# Altium schematic sheet FPGA_BANK_B.SchDoc
size A3; Organization: ICNS, MARCS Institute; Address1: Werrington South Campus, Great Western Highway; Address2: Werrington, NSW, 2747; SheetNumber: 4; SheetTotal: 16
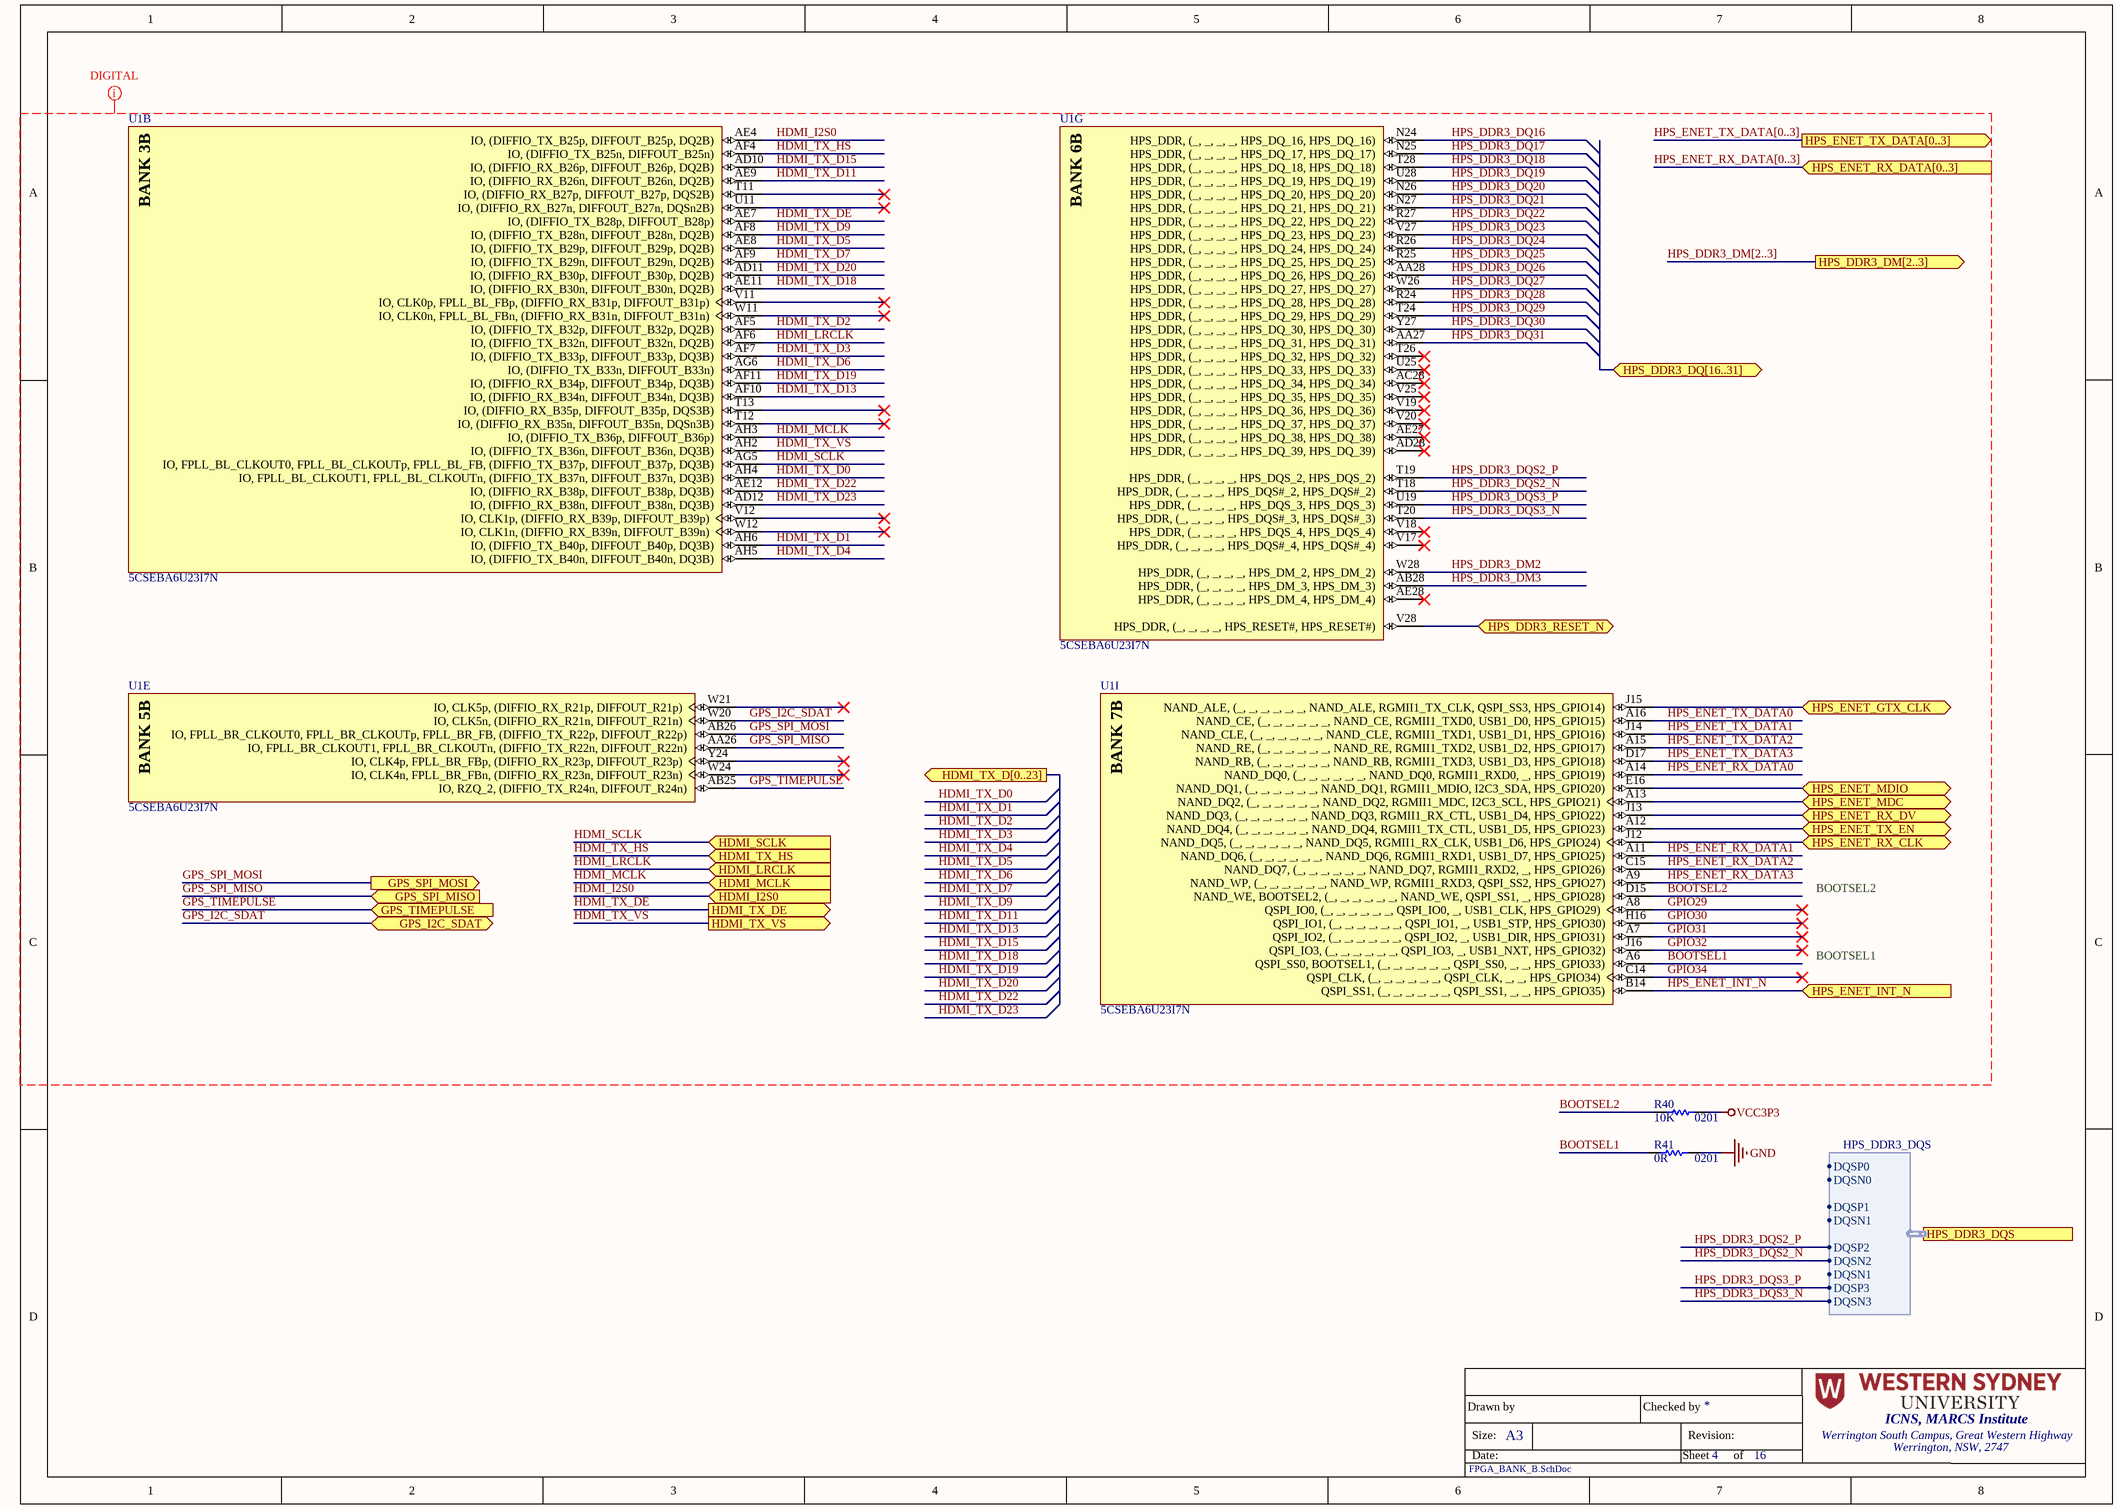
[diagram p0: FPGA_BANK_B.SchDoc]

## Parts
R40  value 10K  Case Code (Imperial): 0201  [RES 0201 (0603)]  (hidden comment: AC0201FR-0710KL)
R41  value 0R  Case Code (Imperial): 0201  [RES 0201 (0603)]  (hidden comment: AF0201JR-070RL)
U1  5CSEBA6U23I7N  [ALTR-UBGA672_A-185]  (parts B,E,G,I of 21)

## Ports
GPS_I2C_SDAT (bidir), GPS_SPI_MISO (in), GPS_SPI_MOSI (out), GPS_TIMEPULSE (in), HDMI_I2S0 (in), HDMI_LRCLK (in), HDMI_MCLK (in), HDMI_SCLK (in), HDMI_TX_D[0..23] (out), HDMI_TX_DE (out), HDMI_TX_HS (in), HDMI_TX_VS (out), HPS_DDR3_DM[2..3] (out), HPS_DDR3_DQ[16..31] (bidir), HPS_DDR3_DQS (harness HPS_DDR3_DQS), HPS_DDR3_RESET_N (bidir), HPS_ENET_GTX_CLK (bidir), HPS_ENET_INT_N (in), HPS_ENET_MDC (bidir), HPS_ENET_MDIO (bidir), HPS_ENET_RX_CLK (bidir), HPS_ENET_RX_DATA[0..3] (in), HPS_ENET_RX_DV (bidir), HPS_ENET_TX_DATA[0..3] (out), HPS_ENET_TX_EN (bidir)

## Harnesses
HPS_DDR3_DQS: DQSP0, DQSP1, DQSP2, DQSP3, DQSN0, DQSN1, DQSN2, DQSN3, DQSN1

## Nets
GND: R41.2
VCC3P3: R40.1
BOOTSEL1: R41.1 U1.A6(QSPI_SS0,_BOOTSEL1,_(_,__,__,__,__,__,_QSPI_SS0,__,__,_HPS_GPIO33))
BOOTSEL2: R40.2 U1.D15(NAND_WE,_BOOTSEL2,_(_,__,__,__,__,__,_NAND_WE,_QSPI_SS1,__,_HPS_GPIO28))
GPIO29: U1.A8(QSPI_IO0,_(_,__,__,__,__,__,_QSPI_IO0,__,_USB1_CLK,_HPS_GPIO29))
GPIO30: U1.H16(QSPI_IO1,_(_,__,__,__,__,__,_QSPI_IO1,__,_USB1_STP,_HPS_GPIO30))
GPIO31: U1.A7(QSPI_IO2,_(_,__,__,__,__,__,_QSPI_IO2,__,_USB1_DIR,_HPS_GPIO31))
GPIO32: U1.J16(QSPI_IO3,_(_,__,__,__,__,__,_QSPI_IO3,__,_USB1_NXT,_HPS_GPIO32))
GPIO34: U1.C14(QSPI_CLK,_(_,__,__,__,__,__,_QSPI_CLK,__,__,_HPS_GPIO34))
GPS_I2C_SDAT: U1.W20(IO,_CLK5n,_(DIFFIO_RX_R21n,_DIFFOUT_R21n)) ; port GPS_I2C_SDAT
GPS_SPI_MISO: U1.AA26(IO,_FPLL_BR_CLKOUT1,_FPLL_BR_CLKOUTn,_(DIFFIO_TX_R22n,_DIFFOUT_R22n)) ; port GPS_SPI_MISO
GPS_SPI_MOSI: U1.AB26(IO,_FPLL_BR_CLKOUT0,_FPLL_BR_CLKOUTp,_FPLL_BR_FB,_(DIFFIO_TX_R22p,_DIFFOUT_R22p)) ; port GPS_SPI_MOSI
GPS_TIMEPULSE: U1.AB25(IO,_RZQ_2,_(DIFFIO_TX_R24n,_DIFFOUT_R24n)) ; port GPS_TIMEPULSE
HDMI_I2S0: U1.AE4(IO,_(DIFFIO_TX_B25p,_DIFFOUT_B25p,_DQ2B)) ; port HDMI_I2S0
HDMI_LRCLK: U1.AF6(IO,_(DIFFIO_TX_B32n,_DIFFOUT_B32n,_DQ2B)) ; port HDMI_LRCLK
HDMI_MCLK: U1.AH3(IO,_(DIFFIO_TX_B36p,_DIFFOUT_B36p)) ; port HDMI_MCLK
HDMI_SCLK: U1.AG5(IO,_FPLL_BL_CLKOUT0,_FPLL_BL_CLKOUTp,_FPLL_BL_FB,_(DIFFIO_TX_B37p,_DIFFOUT_B37p,_DQ3B)) ; port HDMI_SCLK
HDMI_TX_D0: U1.AH4(IO,_FPLL_BL_CLKOUT1,_FPLL_BL_CLKOUTn,_(DIFFIO_TX_B37n,_DIFFOUT_B37n,_DQ3B))
HDMI_TX_D1: U1.AH6(IO,_(DIFFIO_TX_B40p,_DIFFOUT_B40p,_DQ3B))
HDMI_TX_D2: U1.AF5(IO,_(DIFFIO_TX_B32p,_DIFFOUT_B32p,_DQ2B))
HDMI_TX_D3: U1.AF7(IO,_(DIFFIO_TX_B33p,_DIFFOUT_B33p,_DQ3B))
HDMI_TX_D4: U1.AH5(IO,_(DIFFIO_TX_B40n,_DIFFOUT_B40n,_DQ3B))
HDMI_TX_D5: U1.AE8(IO,_(DIFFIO_TX_B29p,_DIFFOUT_B29p,_DQ2B))
HDMI_TX_D6: U1.AG6(IO,_(DIFFIO_TX_B33n,_DIFFOUT_B33n))
HDMI_TX_D7: U1.AF9(IO,_(DIFFIO_TX_B29n,_DIFFOUT_B29n,_DQ2B))
HDMI_TX_D9: U1.AF8(IO,_(DIFFIO_TX_B28n,_DIFFOUT_B28n,_DQ2B))
HDMI_TX_D11: U1.AE9(IO,_(DIFFIO_RX_B26n,_DIFFOUT_B26n,_DQ2B))
HDMI_TX_D13: U1.AF10(IO,_(DIFFIO_RX_B34n,_DIFFOUT_B34n,_DQ3B))
HDMI_TX_D15: U1.AD10(IO,_(DIFFIO_RX_B26p,_DIFFOUT_B26p,_DQ2B))
HDMI_TX_D18: U1.AE11(IO,_(DIFFIO_RX_B30n,_DIFFOUT_B30n,_DQ2B))
HDMI_TX_D19: U1.AF11(IO,_(DIFFIO_RX_B34p,_DIFFOUT_B34p,_DQ3B))
HDMI_TX_D20: U1.AD11(IO,_(DIFFIO_RX_B30p,_DIFFOUT_B30p,_DQ2B))
HDMI_TX_D22: U1.AE12(IO,_(DIFFIO_RX_B38p,_DIFFOUT_B38p,_DQ3B))
HDMI_TX_D23: U1.AD12(IO,_(DIFFIO_RX_B38n,_DIFFOUT_B38n,_DQ3B))
HDMI_TX_DE: U1.AE7(IO,_(DIFFIO_TX_B28p,_DIFFOUT_B28p)) ; port HDMI_TX_DE
HDMI_TX_HS: U1.AF4(IO,_(DIFFIO_TX_B25n,_DIFFOUT_B25n)) ; port HDMI_TX_HS
HDMI_TX_VS: U1.AH2(IO,_(DIFFIO_TX_B36n,_DIFFOUT_B36n,_DQ3B)) ; port HDMI_TX_VS
HPS_DDR3_DM2: U1.W28(HPS_DDR,_(_,__,__,__,_HPS_DM_2,_HPS_DM_2))
HPS_DDR3_DM3: U1.AB28(HPS_DDR,_(_,__,__,__,_HPS_DM_3,_HPS_DM_3))
HPS_DDR3_DQ16: U1.N24(HPS_DDR,_(_,__,__,__,_HPS_DQ_16,_HPS_DQ_16))
HPS_DDR3_DQ17: U1.N25(HPS_DDR,_(_,__,__,__,_HPS_DQ_17,_HPS_DQ_17))
HPS_DDR3_DQ18: U1.T28(HPS_DDR,_(_,__,__,__,_HPS_DQ_18,_HPS_DQ_18))
HPS_DDR3_DQ19: U1.U28(HPS_DDR,_(_,__,__,__,_HPS_DQ_19,_HPS_DQ_19))
HPS_DDR3_DQ20: U1.N26(HPS_DDR,_(_,__,__,__,_HPS_DQ_20,_HPS_DQ_20))
HPS_DDR3_DQ21: U1.N27(HPS_DDR,_(_,__,__,__,_HPS_DQ_21,_HPS_DQ_21))
HPS_DDR3_DQ22: U1.R27(HPS_DDR,_(_,__,__,__,_HPS_DQ_22,_HPS_DQ_22))
HPS_DDR3_DQ23: U1.V27(HPS_DDR,_(_,__,__,__,_HPS_DQ_23,_HPS_DQ_23))
HPS_DDR3_DQ24: U1.R26(HPS_DDR,_(_,__,__,__,_HPS_DQ_24,_HPS_DQ_24))
HPS_DDR3_DQ25: U1.R25(HPS_DDR,_(_,__,__,__,_HPS_DQ_25,_HPS_DQ_25))
HPS_DDR3_DQ26: U1.AA28(HPS_DDR,_(_,__,__,__,_HPS_DQ_26,_HPS_DQ_26))
HPS_DDR3_DQ27: U1.W26(HPS_DDR,_(_,__,__,__,_HPS_DQ_27,_HPS_DQ_27))
HPS_DDR3_DQ28: U1.R24(HPS_DDR,_(_,__,__,__,_HPS_DQ_28,_HPS_DQ_28))
HPS_DDR3_DQ29: U1.T24(HPS_DDR,_(_,__,__,__,_HPS_DQ_29,_HPS_DQ_29))
HPS_DDR3_DQ30: U1.Y27(HPS_DDR,_(_,__,__,__,_HPS_DQ_30,_HPS_DQ_30))
HPS_DDR3_DQ31: U1.AA27(HPS_DDR,_(_,__,__,__,_HPS_DQ_31,_HPS_DQ_31))
HPS_DDR3_DQS2_N: U1.T18(HPS_DDR,_(_,__,__,__,_HPS_DQS#_2,_HPS_DQS#_2)) ; port HPS_DDR3_DQS.DQSN2
HPS_DDR3_DQS2_P: U1.T19(HPS_DDR,_(_,__,__,__,_HPS_DQS_2,_HPS_DQS_2)) ; port HPS_DDR3_DQS.DQSP2
HPS_DDR3_DQS3_N: U1.T20(HPS_DDR,_(_,__,__,__,_HPS_DQS#_3,_HPS_DQS#_3)) ; port HPS_DDR3_DQS.DQSN3
HPS_DDR3_DQS3_P: U1.U19(HPS_DDR,_(_,__,__,__,_HPS_DQS_3,_HPS_DQS_3)) ; port HPS_DDR3_DQS.DQSP3
HPS_DDR3_RESET_N: U1.V28(HPS_DDR,_(_,__,__,__,_HPS_RESET#,_HPS_RESET#)) ; port HPS_DDR3_RESET_N
HPS_ENET_GTX_CLK: U1.J15(NAND_ALE,_(_,__,__,__,__,__,_NAND_ALE,_RGMII1_TX_CLK,_QSPI_SS3,_HPS_GPIO14)) ; port HPS_ENET_GTX_CLK
HPS_ENET_INT_N: U1.B14(QSPI_SS1,_(_,__,__,__,__,__,_QSPI_SS1,__,__,_HPS_GPIO35)) ; port HPS_ENET_INT_N
HPS_ENET_MDC: U1.A13(NAND_DQ2,_(_,__,__,__,__,__,_NAND_DQ2,_RGMII1_MDC,_I2C3_SCL,_HPS_GPIO21)) ; port HPS_ENET_MDC
HPS_ENET_MDIO: U1.E16(NAND_DQ1,_(_,__,__,__,__,__,_NAND_DQ1,_RGMII1_MDIO,_I2C3_SDA,_HPS_GPIO20)) ; port HPS_ENET_MDIO
HPS_ENET_RX_CLK: U1.J12(NAND_DQ5,_(_,__,__,__,__,__,_NAND_DQ5,_RGMII1_RX_CLK,_USB1_D6,_HPS_GPIO24)) ; port HPS_ENET_RX_CLK
HPS_ENET_RX_DATA0: U1.A14(NAND_DQ0,_(_,__,__,__,__,__,_NAND_DQ0,_RGMII1_RXD0,__,_HPS_GPIO19))
HPS_ENET_RX_DATA1: U1.A11(NAND_DQ6,_(_,__,__,__,__,__,_NAND_DQ6,_RGMII1_RXD1,_USB1_D7,_HPS_GPIO25))
HPS_ENET_RX_DATA2: U1.C15(NAND_DQ7,_(_,__,__,__,__,__,_NAND_DQ7,_RGMII1_RXD2,__,_HPS_GPIO26))
HPS_ENET_RX_DATA3: U1.A9(NAND_WP,_(_,__,__,__,__,__,_NAND_WP,_RGMII1_RXD3,_QSPI_SS2,_HPS_GPIO27))
HPS_ENET_RX_DV: U1.J13(NAND_DQ3,_(_,__,__,__,__,__,_NAND_DQ3,_RGMII1_RX_CTL,_USB1_D4,_HPS_GPIO22)) ; port HPS_ENET_RX_DV
HPS_ENET_TX_DATA0: U1.A16(NAND_CE,_(_,__,__,__,__,__,_NAND_CE,_RGMII1_TXD0,_USB1_D0,_HPS_GPIO15))
HPS_ENET_TX_DATA1: U1.J14(NAND_CLE,_(_,__,__,__,__,__,_NAND_CLE,_RGMII1_TXD1,_USB1_D1,_HPS_GPIO16))
HPS_ENET_TX_DATA2: U1.A15(NAND_RE,_(_,__,__,__,__,__,_NAND_RE,_RGMII1_TXD2,_USB1_D2,_HPS_GPIO17))
HPS_ENET_TX_DATA3: U1.D17(NAND_RB,_(_,__,__,__,__,__,_NAND_RB,_RGMII1_TXD3,_USB1_D3,_HPS_GPIO18))
HPS_ENET_TX_EN: U1.A12(NAND_DQ4,_(_,__,__,__,__,__,_NAND_DQ4,_RGMII1_TX_CTL,_USB1_D5,_HPS_GPIO23)) ; port HPS_ENET_TX_EN

Not connected (* = marked no-connect by the designer): U1 AC28(HPS_DDR,_(_,__,__,__,_HPS_DQ_34,_HPS_DQ_34))* AD28(HPS_DDR,_(_,__,__,__,_HPS_DQ_39,_HPS_DQ_39))* AE27(HPS_DDR,_(_,__,__,__,_HPS_DQ_38,_HPS_DQ_38))* AE28(HPS_DDR,_(_,__,__,__,_HPS_DM_4,_HPS_DM_4))* T11(IO,_(DIFFIO_RX_B27p,_DIFFOUT_B27p,_DQS2B))* T12(IO,_(DIFFIO_RX_B35n,_DIFFOUT_B35n,_DQSn3B))* T13(IO,_(DIFFIO_RX_B35p,_DIFFOUT_B35p,_DQS3B))* T26(HPS_DDR,_(_,__,__,__,_HPS_DQ_32,_HPS_DQ_32))* U11(IO,_(DIFFIO_RX_B27n,_DIFFOUT_B27n,_DQSn2B))* U25(HPS_DDR,_(_,__,__,__,_HPS_DQ_33,_HPS_DQ_33))* V11(IO,_CLK0p,_FPLL_BL_FBp,_(DIFFIO_RX_B31p,_DIFFOUT_B31p))* V12(IO,_CLK1p,_(DIFFIO_RX_B39p,_DIFFOUT_B39p))* V17(HPS_DDR,_(_,__,__,__,_HPS_DQS#_4,_HPS_DQS#_4))* V18(HPS_DDR,_(_,__,__,__,_HPS_DQS_4,_HPS_DQS_4))* V19(HPS_DDR,_(_,__,__,__,_HPS_DQ_36,_HPS_DQ_36))* V20(HPS_DDR,_(_,__,__,__,_HPS_DQ_37,_HPS_DQ_37))* V25(HPS_DDR,_(_,__,__,__,_HPS_DQ_35,_HPS_DQ_35))* W11(IO,_CLK0n,_FPLL_BL_FBn,_(DIFFIO_RX_B31n,_DIFFOUT_B31n))* W12(IO,_CLK1n,_(DIFFIO_RX_B39n,_DIFFOUT_B39n))* W21(IO,_CLK5p,_(DIFFIO_RX_R21p,_DIFFOUT_R21p))* W24(IO,_CLK4n,_FPLL_BR_FBn,_(DIFFIO_RX_R23n,_DIFFOUT_R23n))* Y24(IO,_CLK4p,_FPLL_BR_FBp,_(DIFFIO_RX_R23p,_DIFFOUT_R23p))*

## Buses and harness runs
bus HPS_DDR3_DM[2..3] = port HPS_DDR3_DM[2..3]
bus HPS_ENET_RX_DATA[0..3] = port HPS_ENET_RX_DATA[0..3]
bus HPS_ENET_TX_DATA[0..3] = port HPS_ENET_TX_DATA[0..3]

## Layout directives
net class DIGITAL: BOOTSEL1, BOOTSEL2, GPIO29, GPIO30, GPIO31, GPIO32, GPIO34, GPS_I2C_SDAT, GPS_SPI_MISO, GPS_SPI_MOSI, GPS_TIMEPULSE, HDMI_I2S0, HDMI_LRCLK, HDMI_MCLK, HDMI_SCLK, HDMI_TX_D0, HDMI_TX_D1, HDMI_TX_D2, HDMI_TX_D3, HDMI_TX_D4, HDMI_TX_D5, HDMI_TX_D6, HDMI_TX_D7, HDMI_TX_D9, HDMI_TX_D11, HDMI_TX_D13, HDMI_TX_D15, HDMI_TX_D18, HDMI_TX_D19, HDMI_TX_D20, HDMI_TX_D22, HDMI_TX_D23, HDMI_TX_DE, HDMI_TX_HS, HDMI_TX_VS, HPS_DDR3_DM2, HPS_DDR3_DM3, HPS_DDR3_DM[2..3], HPS_DDR3_DQ16, HPS_DDR3_DQ17, HPS_DDR3_DQ18, HPS_DDR3_DQ19, HPS_DDR3_DQ20, HPS_DDR3_DQ21, HPS_DDR3_DQ22, HPS_DDR3_DQ23, HPS_DDR3_DQ24, HPS_DDR3_DQ25, HPS_DDR3_DQ26, HPS_DDR3_DQ27, HPS_DDR3_DQ28, HPS_DDR3_DQ29, HPS_DDR3_DQ30, HPS_DDR3_DQ31, HPS_DDR3_DQS2_N, HPS_DDR3_DQS2_P, HPS_DDR3_DQS3_N, HPS_DDR3_DQS3_P, HPS_ENET_INT_N, HPS_ENET_RX_DATA0, HPS_ENET_RX_DATA1, HPS_ENET_RX_DATA2, HPS_ENET_RX_DATA3, HPS_ENET_RX_DATA[0..3], HPS_ENET_TX_DATA0, HPS_ENET_TX_DATA1, HPS_ENET_TX_DATA2, HPS_ENET_TX_DATA3, HPS_ENET_TX_DATA[0..3]

## Notes on the sheet
- BOOTSEL2
- BOOTSEL1
- Drawn by
- Size:
- Date:
- A3
- Checked by
- Sheet
- Revision:
- of
- (in symbol CMP-005-000007-1, part B) BANK 3B
- (in symbol CMP-005-000007-1, part E) BANK 5B
- (in symbol CMP-005-000007-1, part G) BANK 6B
- (in symbol CMP-005-000007-1, part I) BANK 7B

## Library data of the parts
R40 = CMP-006-000021-1: Res Thick Film 0201 10K Ohm 1% 0.05W(1/20W) ±200ppm/C Pad SMD Automotive T/R; Manufacturer: Yageo; Max Power Dissipation: 50mW; Resistance: 10kR; Temperature Coefficient: 200ppm/°C; Length: 0.024inch; Packaging: Tape and Reel; ComponentLink1URL: http://www.yageo.com/NewPortal/yageodocoutput?fileName=/pdf/R-Chip/PYu-AC_51_RoHS_L_6.pdf&src-supplier=Digi-Key; Number of Terminations: 2; Case/Package: 0201; Source: ICNS_PropheseeLib.SchLib; Case Code (Metric): 0603; Manufacturer Part Number: AC0201FR-0710KL; ComponentLink1Description: http://www.yageo.com/NewPortal/yageodocoutput?fileName=/pdf/R-Chip/PYu-AC_51_RoHS_L_6.pdf&src-supplier=Digi-Key; Min Operating Temperature: -55°C; Category: Chip SMD Resistors; Width: 0.012inch; RoHS: Yes; Max Operating Temperature: 155°C; Features: Moisture Resistant,Automotive AEC-Q200; Pricing 1: 1=0.10000, 10=0.06600, 100=0.02670, 1000=0.01201, 2500=0.01042, 5000=0.00861 (USD); Resistor Type: Thick Film; Stock 1: 698280; Design Item ID: AC0201FR-0710KL; Height: 0.01inch; Tolerance: 1%
R41 = CMP-006-000020-1: Res Thick Film 0201 0 Ohm Sulfur Resistant Pad SMD Automotive T/R; Manufacturer: Yageo; Max Power Dissipation: 50mW; Resistance: 0mR; Width: 0.012inch; Min Operating Temperature: -55°C; ComponentLink1Description: http://www.mouser.com/ds/2/447/PYu-AF_51_RoHS_L_5-1085711.pdf?src-supplier=Mouser; Stock 1: 50009; Termination: SMD/SMT; RoHS: Yes; Design Item ID: AF0201JR-070RL; ComponentLink2Description: http://www.yageo.com/documents/recent/PYu-AF_51_RoHS_L_5.pdf?src-supplier=Digi-Key; Package Quantity: 10000; Case Code (Metric): 0603; Length: 0.024inch; Weight: 6E-06oz; ComponentLink1URL: http://www.mouser.com/ds/2/447/PYu-AF_51_RoHS_L_5-1085711.pdf?src-supplier=Mouser; Case/Package: 0201; RoHS Compliant: Yes; Pricing 1: 1=0.11000, 10=0.09500, 25=0.06560, 50=0.05100, 100=0.03640, 250=0.02840, 500=0.02256, 1000=0.01602, 5000=0.01238 (USD); Height: 0.01inch; Resistor Type: Thick Film; ComponentLink2URL: http://www.yageo.com/documents/recent/PYu-AF_51_RoHS_L_5.pdf?src-supplier=Digi-Key; Source: ICNS_PropheseeLib.SchLib; Max Operating Temperature: 125°C; Number of Terminations: 2; Manufacturer Part Number: AF0201JR-070RL; Features: Moisture Resistant,Anti-Sulfur; Packaging: Tape and Reel; Category: Chip SMD Resistors
U1 = CMP-005-000007-1: Cyclone V SE Family FPGA, 1.07 to 1.13 V Supply, 145 I/O Pins, 6 PLLs, 672-Pin UBGA, Speed Grade 7, Industrial Grade, RoHS Compliant; Manufacturer: Altera; Speed Grade: 7; Logic Elements (LE) (K): 110; NexusDeviceID: 5CSEBA6U23I7N; Voltage Supply: 1.07 to 1.13 V; ComponentLink5Description: Device Pin-Out URL; ComponentLink3URL: http://www.altera.com/devicepackaging/04R00437-01.pdf; Code_JEDEC: MO-216; ComponentLink1URL: http://www.altera.com; DatasheetVersion: Rev. 3.4; ComponentLink6Description: Product URL; PackageReference: UBGA672_A-185; PackageDescription: 672-Pin Ultra FineLine Ball-Grid Array (UBGA), Body 23 x 23 mm, Pitch 0.8 mm; PackageVersion: Rev. 2.0, 12/2012; ComponentLink5URL: http://www.altera.com/literature/dp/cyclone-v/5CSEBA6.xls; ComponentLink4URL: http://www.altera.com/literature/hb/cyclone-v/cyclone5_handbook.pdf; ComponentLink4Description: Device Handbook URL; PartNumber: 5CSEBA6U23I7N; ComponentLink2URL: http://www.altera.com/literature/hb/cyclone-v/cv_51002.pdf; ComponentLink1Description: Manufacturer URL; RoHS: RoHS Compliant; Device Group: 5CSEBA6; ComponentLink3Description: Package Specification; ComponentLink2Description: Datasheet; Subcategory: Cyclone V SE; ComponentLink6URL: http://www.buyaltera.com/scripts/partsearch.dll?Detail&name=5CSEBA6U23I7N-ND; Mounting Technology: Surface Mount; Design Item ID: 5CSEBA6U23I7N; Source: ICNS_PropheseeLib.SchLib